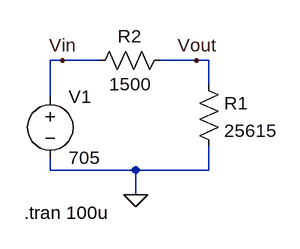
[diagram p0: schematic Voltage Divider.asc]
Voltage Divider.asc, the LTspice schematic file:
Version 4
SHEET 1 880 680
WIRE 96 128 80 128
WIRE 144 128 96 128
WIRE 272 128 224 128
WIRE 288 128 272 128
WIRE 288 160 288 128
WIRE 80 176 80 128
WIRE 80 272 80 256
WIRE 192 272 80 272
WIRE 288 272 288 240
WIRE 288 272 192 272
WIRE 192 304 192 272
FLAG 192 304 0
FLAG 96 128 Vin
FLAG 272 128 Vout
SYMBOL voltage 80 160 R0
WINDOW 123 0 0 Left 2
WINDOW 39 0 0 Left 2
SYMATTR InstName V1
SYMATTR Value 705
SYMBOL res 272 144 R0
SYMATTR InstName R1
SYMATTR Value 25615
SYMBOL res 240 112 R90
WINDOW 0 0 56 VBottom 2
WINDOW 3 32 56 VTop 2
SYMATTR InstName R2
SYMATTR Value 1500
TEXT 46 328 Left 2 !.tran 100u

The netlist it stands for:
* Voltage Divider.asc
V1 Vin 0 705
R1 Vout 0 25615
R2 Vout Vin 1500
.tran 100u
.backanno
.end